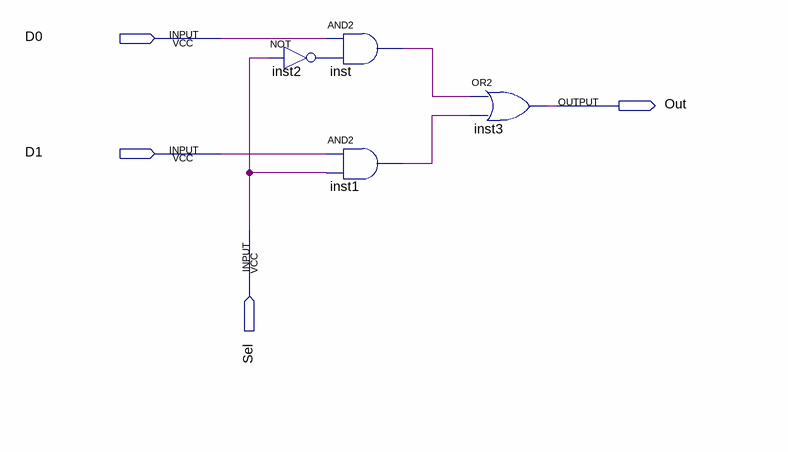
[diagram p0: schematic sheet]
// Quartus schematic 2_1_mux.bdf as structural Verilog: 4 symbols, 4 pins
module \2_1_mux  (
  input  D0,
  input  D1,
  input  Sel,
  output Out
);

  wire inst1_out, inst2_out, inst_out;

  and inst (inst_out, D0, inst2_out);
  not inst2 (inst2_out, Sel);
  and inst1 (inst1_out, D1, Sel);
  or inst3 (Out, inst_out, inst1_out);
endmodule
